# EAGLE design Main (EAGLE 9.5.1)

## Sheet 1 of 2
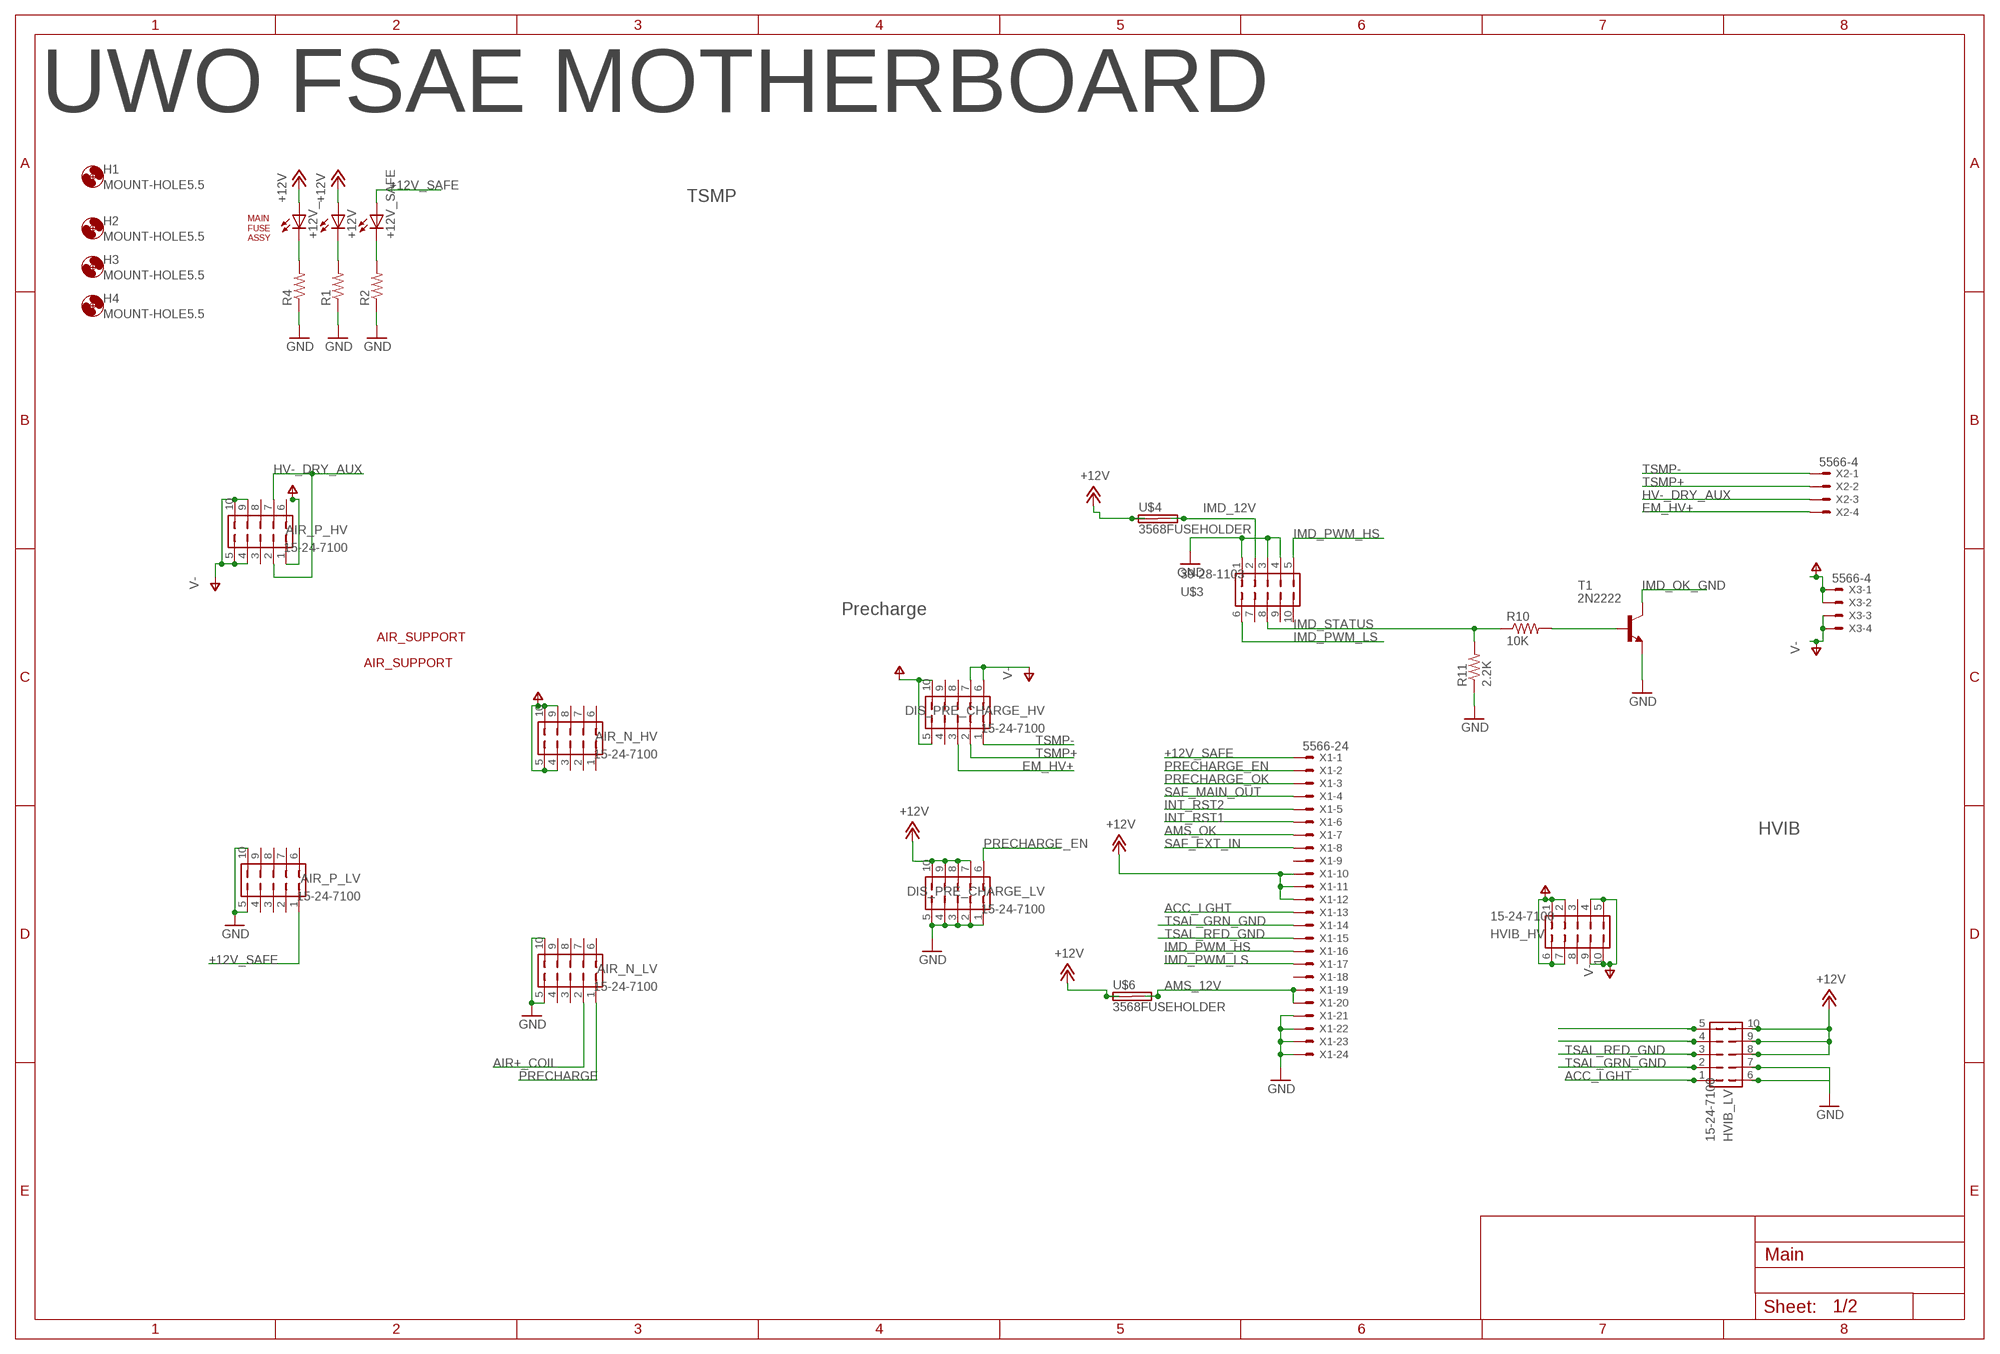
[diagram p0: schematic, sheet 1]

### Parts
+12V  LED3MM  [LED3MM]
+12V_  LED3MM  [LED3MM]
+12V_SAFE  LED3MM  [LED3MM]
AIR_N_HV  15-24-7100  [5566-10-BMI]
AIR_N_LV  15-24-7100  [5566-10-BMI]
AIR_P_HV  15-24-7100  [5566-10-BMI]
AIR_P_LV  15-24-7100  [5566-10-BMI]
DIS_PRE_CHARGE_HV  15-24-7100  [5566-10-BMI]
DIS_PRE_CHARGE_LV  15-24-7100  [5566-10-BMI]
H1  MOUNT-HOLE5.5  [5,5]
H2  MOUNT-HOLE5.5  [5,5]
H3  MOUNT-HOLE5.5  [5,5]
H4  MOUNT-HOLE5.5  [5,5]
HVIB_HV  15-24-7100  [5566-10-BMI]
HVIB_LV  15-24-7100  [5566-10-BMI]
R1  R-US_R0805  [R0805]
R2  R-US_R0805  [R0805]
R4  R-US_R0805  [R0805]
R10  10K  R-US_M0805  [M0805]
R11  2.2K  R-US_M0805  [M0805]
T1  2N2222  [TO92-EBC-OVAL]
U$1  MAINFUSEASSY  [MAINFUSEASSY]
U$3  39-28-1103  [39-28-1103]
U$4  3568FUSEHOLDER  [3568]
U$6  3568FUSEHOLDER  [3568]
U$7  AIR_SUPPORT  [AIR_SUPPORT]
U$8  AIR_SUPPORT  [AIR_SUPPORT]
X1  5566-24  [5566-24]
X2  5566-4  [5566-4]
X3  5566-4  [5566-4]

### Nets
+12V: +12V.A +12V_.A DIS_PRE_CHARGE_LV.7 DIS_PRE_CHARGE_LV.8 DIS_PRE_CHARGE_LV.9 DIS_PRE_CHARGE_LV.10 HVIB_LV.8 HVIB_LV.9 HVIB_LV.10 U$4.L1(1A) U$4.L2(1B) U$6.L1(1A) U$6.L2(1B) X1.10 X1.11 X1.12 ; also sheet 2
+12V_SAFE: +12V_SAFE.A AIR_P_LV.1 X1.1 ; also sheet 2
ACC_LGHT: HVIB_LV.1 X1.13
AIR+_COIL: AIR_N_LV.2 ; also sheet 2
AMS_12V: U$6.R1(2A) U$6.R2(2B) X1.19 X1.20
AMS_OK: X1.7 ; also sheet 2
EM_HV+: DIS_PRE_CHARGE_HV.3 X2.4
GND: AIR_N_LV.5 AIR_N_LV.10 AIR_P_LV.5 AIR_P_LV.10 DIS_PRE_CHARGE_LV.1 DIS_PRE_CHARGE_LV.2 DIS_PRE_CHARGE_LV.3 DIS_PRE_CHARGE_LV.4 DIS_PRE_CHARGE_LV.5 HVIB_LV.7 R1.1 R2.1 R4.1 R11.1 T1.E U$3.1 U$3.3 U$3.4 X1.21 X1.22 X1.23 X1.24 ; also sheet 2
HV-_DRY_AUX: AIR_P_HV.2 AIR_P_HV.7 X2.3
IMD_12V: U$3.2 U$4.R1(2A) U$4.R2(2B)
IMD_OK_GND: T1.C ; also sheet 2
IMD_PWM_HS: U$3.5 X1.16
IMD_PWM_LS: U$3.6 X1.17
IMD_STATUS: R10.1 R11.2 U$3.8
INT_RST1: X1.6 ; also sheet 2
INT_RST2: X1.5 ; also sheet 2
N$1: HVIB_LV.6
N$2: +12V.K(C) R1.2
N$3: R10.2 T1.B
N$5: +12V_.K(C) R4.2
N$6: +12V_SAFE.K(C) R2.2
N$12: HVIB_LV.4
N$16: HVIB_LV.5
PRECHARGE: AIR_N_LV.1 ; also sheet 2
PRECHARGE_EN: DIS_PRE_CHARGE_LV.6 X1.2 ; also sheet 2
PRECHARGE_OK: X1.3 ; also sheet 2
SAF_EXT_IN: X1.8 ; also sheet 2
SAF_MAIN_OUT: X1.4 ; also sheet 2
TSAL_GRN_GND: HVIB_LV.2 X1.14
TSAL_RED_GND: HVIB_LV.3 X1.15
TSMP+: DIS_PRE_CHARGE_HV.2 X2.2
TSMP-: DIS_PRE_CHARGE_HV.1 X2.1
V+: AIR_N_HV.4 AIR_N_HV.5 AIR_N_HV.9 AIR_N_HV.10 AIR_P_HV.1 AIR_P_HV.6 DIS_PRE_CHARGE_HV.5 DIS_PRE_CHARGE_HV.10 HVIB_HV.1 HVIB_HV.2 HVIB_HV.6 HVIB_HV.7 X3.1 X3.2
V-: AIR_P_HV.4 AIR_P_HV.5 AIR_P_HV.9 AIR_P_HV.10 DIS_PRE_CHARGE_HV.6 DIS_PRE_CHARGE_HV.7 HVIB_HV.4 HVIB_HV.5 HVIB_HV.9 HVIB_HV.10 X3.3 X3.4
Unconnected: AIR_N_HV.1 AIR_N_HV.2 AIR_N_HV.3 AIR_N_HV.6 AIR_N_HV.7 AIR_N_HV.8 AIR_N_LV.3 AIR_N_LV.4 AIR_N_LV.6 AIR_N_LV.7 AIR_N_LV.8 AIR_N_LV.9 AIR_P_HV.3 AIR_P_HV.8 AIR_P_LV.2 AIR_P_LV.3 AIR_P_LV.4 AIR_P_LV.6 AIR_P_LV.7 AIR_P_LV.8 AIR_P_LV.9 DIS_PRE_CHARGE_HV.4 DIS_PRE_CHARGE_HV.8 DIS_PRE_CHARGE_HV.9 HVIB_HV.3 HVIB_HV.8 U$3.7 U$3.9 U$3.10 X1.9 X1.18

### Notes on the sheet
- UWO FSAE MOTHERBOARD
- TSMP
- Precharge
- HVIB

## Sheet 2 of 2
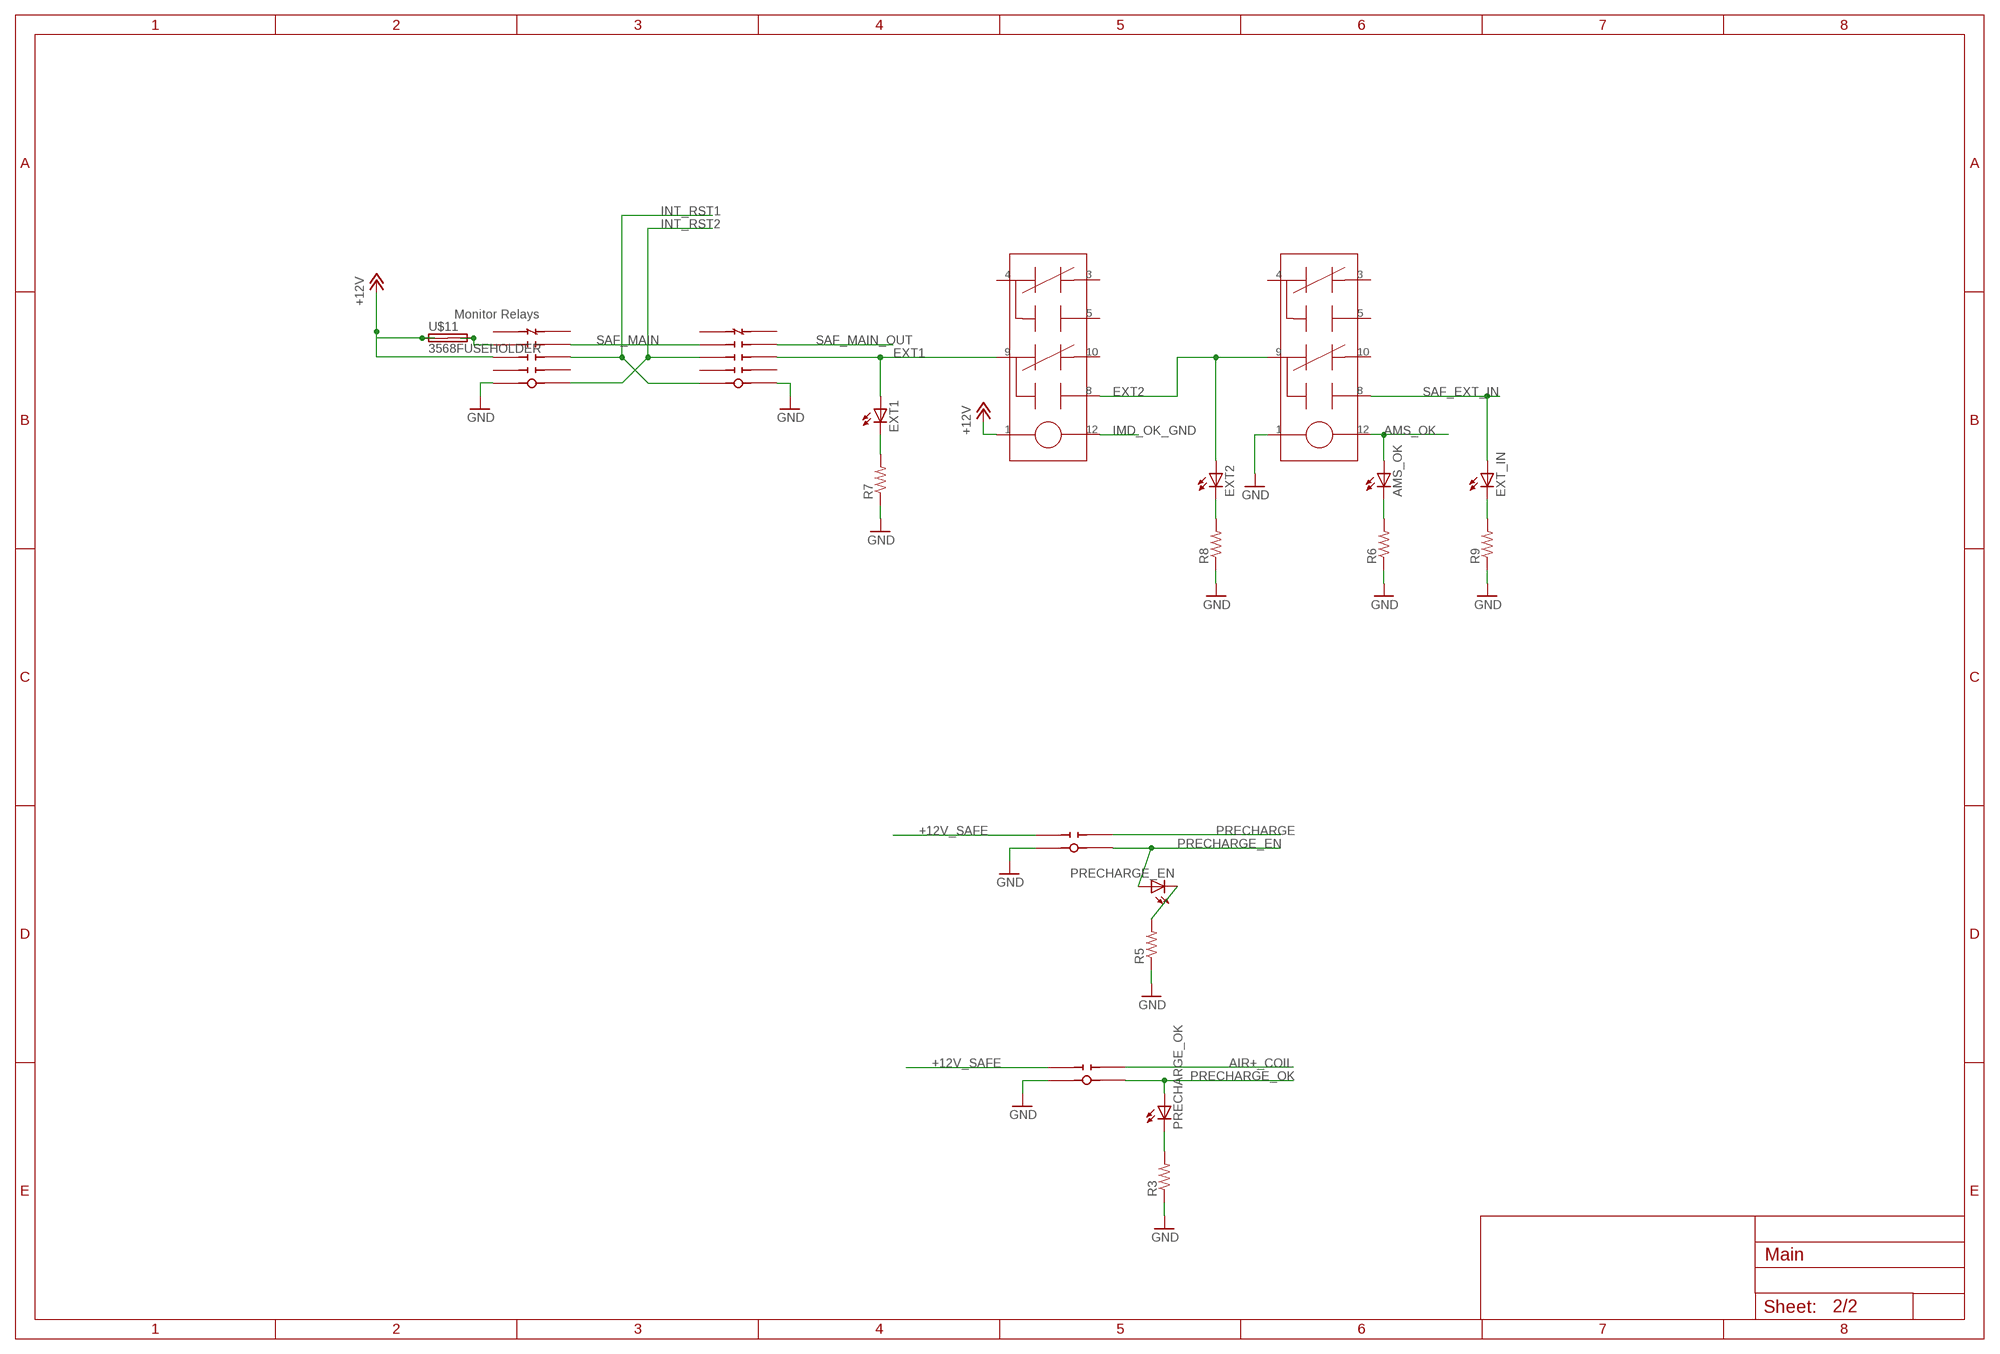
[diagram p1: schematic, sheet 2]

### Parts
AMS_OK  LED3MM  [LED3MM]
EXT1  LED3MM  [LED3MM]
EXT2  LED3MM  [LED3MM]
EXT_IN  LED3MM  [LED3MM]
PRECHARGE_EN  LED3MM  [LED3MM]
PRECHARGE_OK  LED3MM  [LED3MM]
R3  R-US_R0805  [R0805]
R5  R-US_R0805  [R0805]
R6  R-US_R0805  [R0805]
R7  R-US_R0805  [R0805]
R8  R-US_R0805  [R0805]
R9  R-US_R0805  [R0805]
U$2  SR4M4012_TE  [SR4M4012_FOOT]
U$5  SR4M4012_TE  [SR4M4012_FOOT]
U$9  G5NB-1A-E  [G5NB-1A-E]
U$10  G5NB-1A-E  [G5NB-1A-E]
U$11  3568FUSEHOLDER  [3568]
U$12  V23079B1203B301  [V23079B1203B301]
U$13  V23079B1203B301  [V23079B1203B301]

### Nets
+12V: U$2.NOA2 U$11.L1(1A) U$11.L2(1B) U$12.1 ; also sheet 1
+12V_SAFE: U$9.2(NOA1) U$10.2(NOA1) ; also sheet 1
AIR+_COIL: U$9.3(NOB1) ; also sheet 1
AMS_OK: AMS_OK.A U$13.12 ; also sheet 1
EXT1: EXT1.A U$5.NOB2 U$12.9
EXT2: EXT2.A U$12.8 U$13.9
GND: R3.1 R5.1 R6.1 R7.1 R8.1 R9.1 U$2.COIL+ U$5.COIL- U$9.1(COIL+) U$10.1(COIL+) U$13.1 ; also sheet 1
IMD_OK_GND: U$12.12 ; also sheet 1
INT_RST1: U$2.NOB2 U$5.COIL+ ; also sheet 1
INT_RST2: U$2.COIL- U$5.NOA2 ; also sheet 1
N$4: U$2.NOA3 U$11.R1(2A) U$11.R2(2B)
N$7: PRECHARGE_EN.K(C) R5.2
N$8: PRECHARGE_OK.K(C) R3.2
N$11: AMS_OK.K(C) R6.2
N$13: EXT1.K(C) R7.2
N$14: EXT2.K(C) R8.2
N$15: EXT_IN.K(C) R9.2
PRECHARGE: U$10.3(NOB1) ; also sheet 1
PRECHARGE_EN: PRECHARGE_EN.A U$10.4(COIL-) ; also sheet 1
PRECHARGE_OK: PRECHARGE_OK.A U$9.4(COIL-) ; also sheet 1
SAF_EXT_IN: EXT_IN.A U$13.8 ; also sheet 1
SAF_MAIN: U$2.NOB3 U$5.NOA3
SAF_MAIN_OUT: U$5.NOB3 ; also sheet 1
Unconnected: U$2.NCA4 U$2.NCB4 U$2.NOA1 U$2.NOB1 U$5.NCA4 U$5.NCB4 U$5.NOA1 U$5.NOB1 U$12.3 U$12.4 U$12.5 U$12.10 U$13.3 U$13.4 U$13.5 U$13.10

### Notes on the sheet
- Monitor Relays

## Library data of the parts
+12V +12V_ +12V_SAFE AMS_OK EXT1 EXT2 EXT_IN PRECHARGE_EN PRECHARGE_OK = ACC-MB-R0:LED: LED OSRAM: - CHIPLED LG R971, LG N971, LY N971, LG Q971, LY Q971, LO R971, LY R971 LH N974, LH R974 LS Q976, LO Q976, LY Q976 LO Q996 - Hyper CHIPLED LW Q18S LB Q993, LB Q99A, LB R99A - SideLED LS A670, LO A670, LY A670, LG A670, LP A670 LB A673, LV A673, LT A673, LW A673 LH A674 LY A675 LS A676, LA A676, LO A676, LY A676, LW A676 LS A679, LY A679, LG A679 - Hyper Micro SIDELED® LS Y876, LA Y876, LO Y876, LY Y876 LT Y87S - SmartLED LW L88C, LW L88S LB L89C, LB L89S, LG L890 LS L89K, LO L89K, LY L89K LS L896, LA L896, LO L896, LY L896 - TOPLED LS T670, LO T670, LY T670, LG T670, LP T670 LSG T670, LSP T670, LSY T670, LOP T670, LYG T670 LG T671, LOG T671, LSG T671 LB T673, LV T673, LT T673, LW T673 LH T674 LS T676, LA T676, LO T676, LY T676, LB T676, LH T676, LSB T676, LW T676 LB T67C, LV T67C, LT T67C, LS T67K, LO T67K, LY T67K, LW E67C LS E67B, LA E67B, LO E67B, LY E67B, LB E67C, LV E67C, LT E67C LW T67C LS T679, LY T679, LG T679 LS T770, LO T770, LY T770, LG T770, LP T770 LB T773, LV T773, LT T773, LW T773 LH T774 LS E675, LA E675, LY E675, LS T675 LS T776, LA T776, LO T776, LY T776, LB T776 LHGB T686 LT T68C, LB T68C - Hyper Mini TOPLED® LB M676 - Mini TOPLED Santana® LG M470 LS M47K, LO M47K, LY M47K Source: http://www.osram.convergy.de LUXEON: - LUMILED® LXK2-PW12-R00, LXK2-PW12-S00, LXK2-PW14-U00, LXK2-PW14-V00 LXK2-PM12-R00, LXK2-PM12-S00, LXK2-PM14-U00 LXK2-PE12-Q00, LXK2-PE12-R00, LXK2-PE12-S00, LXK2-PE14-T00, LXK2-PE14-U00 LXK2-PB12-K00, LXK2-PB12-L00, LXK2-PB12-M00, LXK2-PB14-N00, LXK2-PB14-P00, LXK2-PB14-Q00 LXK2-PR12-L00, LXK2-PR12-M00, LXK2-PR14-Q00, LXK2-PR14-R00 LXK2-PD12-Q00, LXK2-PD12-R00, LXK2-PD12-S00 LXK2-PH12-R00, LXK2-PH12-S00 LXK2-PL12-P00, LXK2-PL12-Q00, LXK2-PL12-R00 Source: www.luxeon.com KINGBRIGHT: KA-3528ASYC Source: www.kingbright.com
AIR_N_HV AIR_N_LV AIR_P_HV AIR_P_LV DIS_PRE_CHARGE_HV DIS_PRE_CHARGE_LV HVIB_HV HVIB_LV = ACC-MB-R0:15-24-7100
H1-H4 = Main:MOUNT-HOLE: MOUNTING HOLE with drill center marker
R1-R11 = ACC-MB-R0:R-US_: RESISTOR, American symbol; SPICEPREFIX: R
T1 = adafruit:2N2222: NPN TRANSISTOR Big oval pads
U$1 = ACC-MB-R0:MAINFUSEASSY
U$2 U$5 = ACC-MB-R0:SR4M4012_TE
U$3 = ACC-MB-R0:39-28-1103
U$4 U$6 U$11 = ACC-MB-R0:3568FUSEHOLDER: 3568 20AMP 500VAC
U$7 U$8 = ACC-MB-R0:AIR_SUPPORT
U$9 U$10 = ACC-MB-R0:G5NB-1A-E
U$12 U$13 = ACC-MB-R0:V23079B1203B301
X1 = ACC-MB-R0:5566-24: Mini FIT connector 24 pol Source: http://www.molex.com; MF: MOLEX; OC_FARNELL: unknown; OC_NEWARK: unknown
X2 X3 = ACC-MB-R0:5566-4: Mini FIT connector 4 pol Source: http://www.molex.com; MF: MOLEX; OC_FARNELL: unknown; OC_NEWARK: unknown

## Net classes
0 default: width 0.1 mm, clearance 0.4 mm
1 LV: clearance 0.001 mm
2 HV: clearance 2.5 mm

## Board
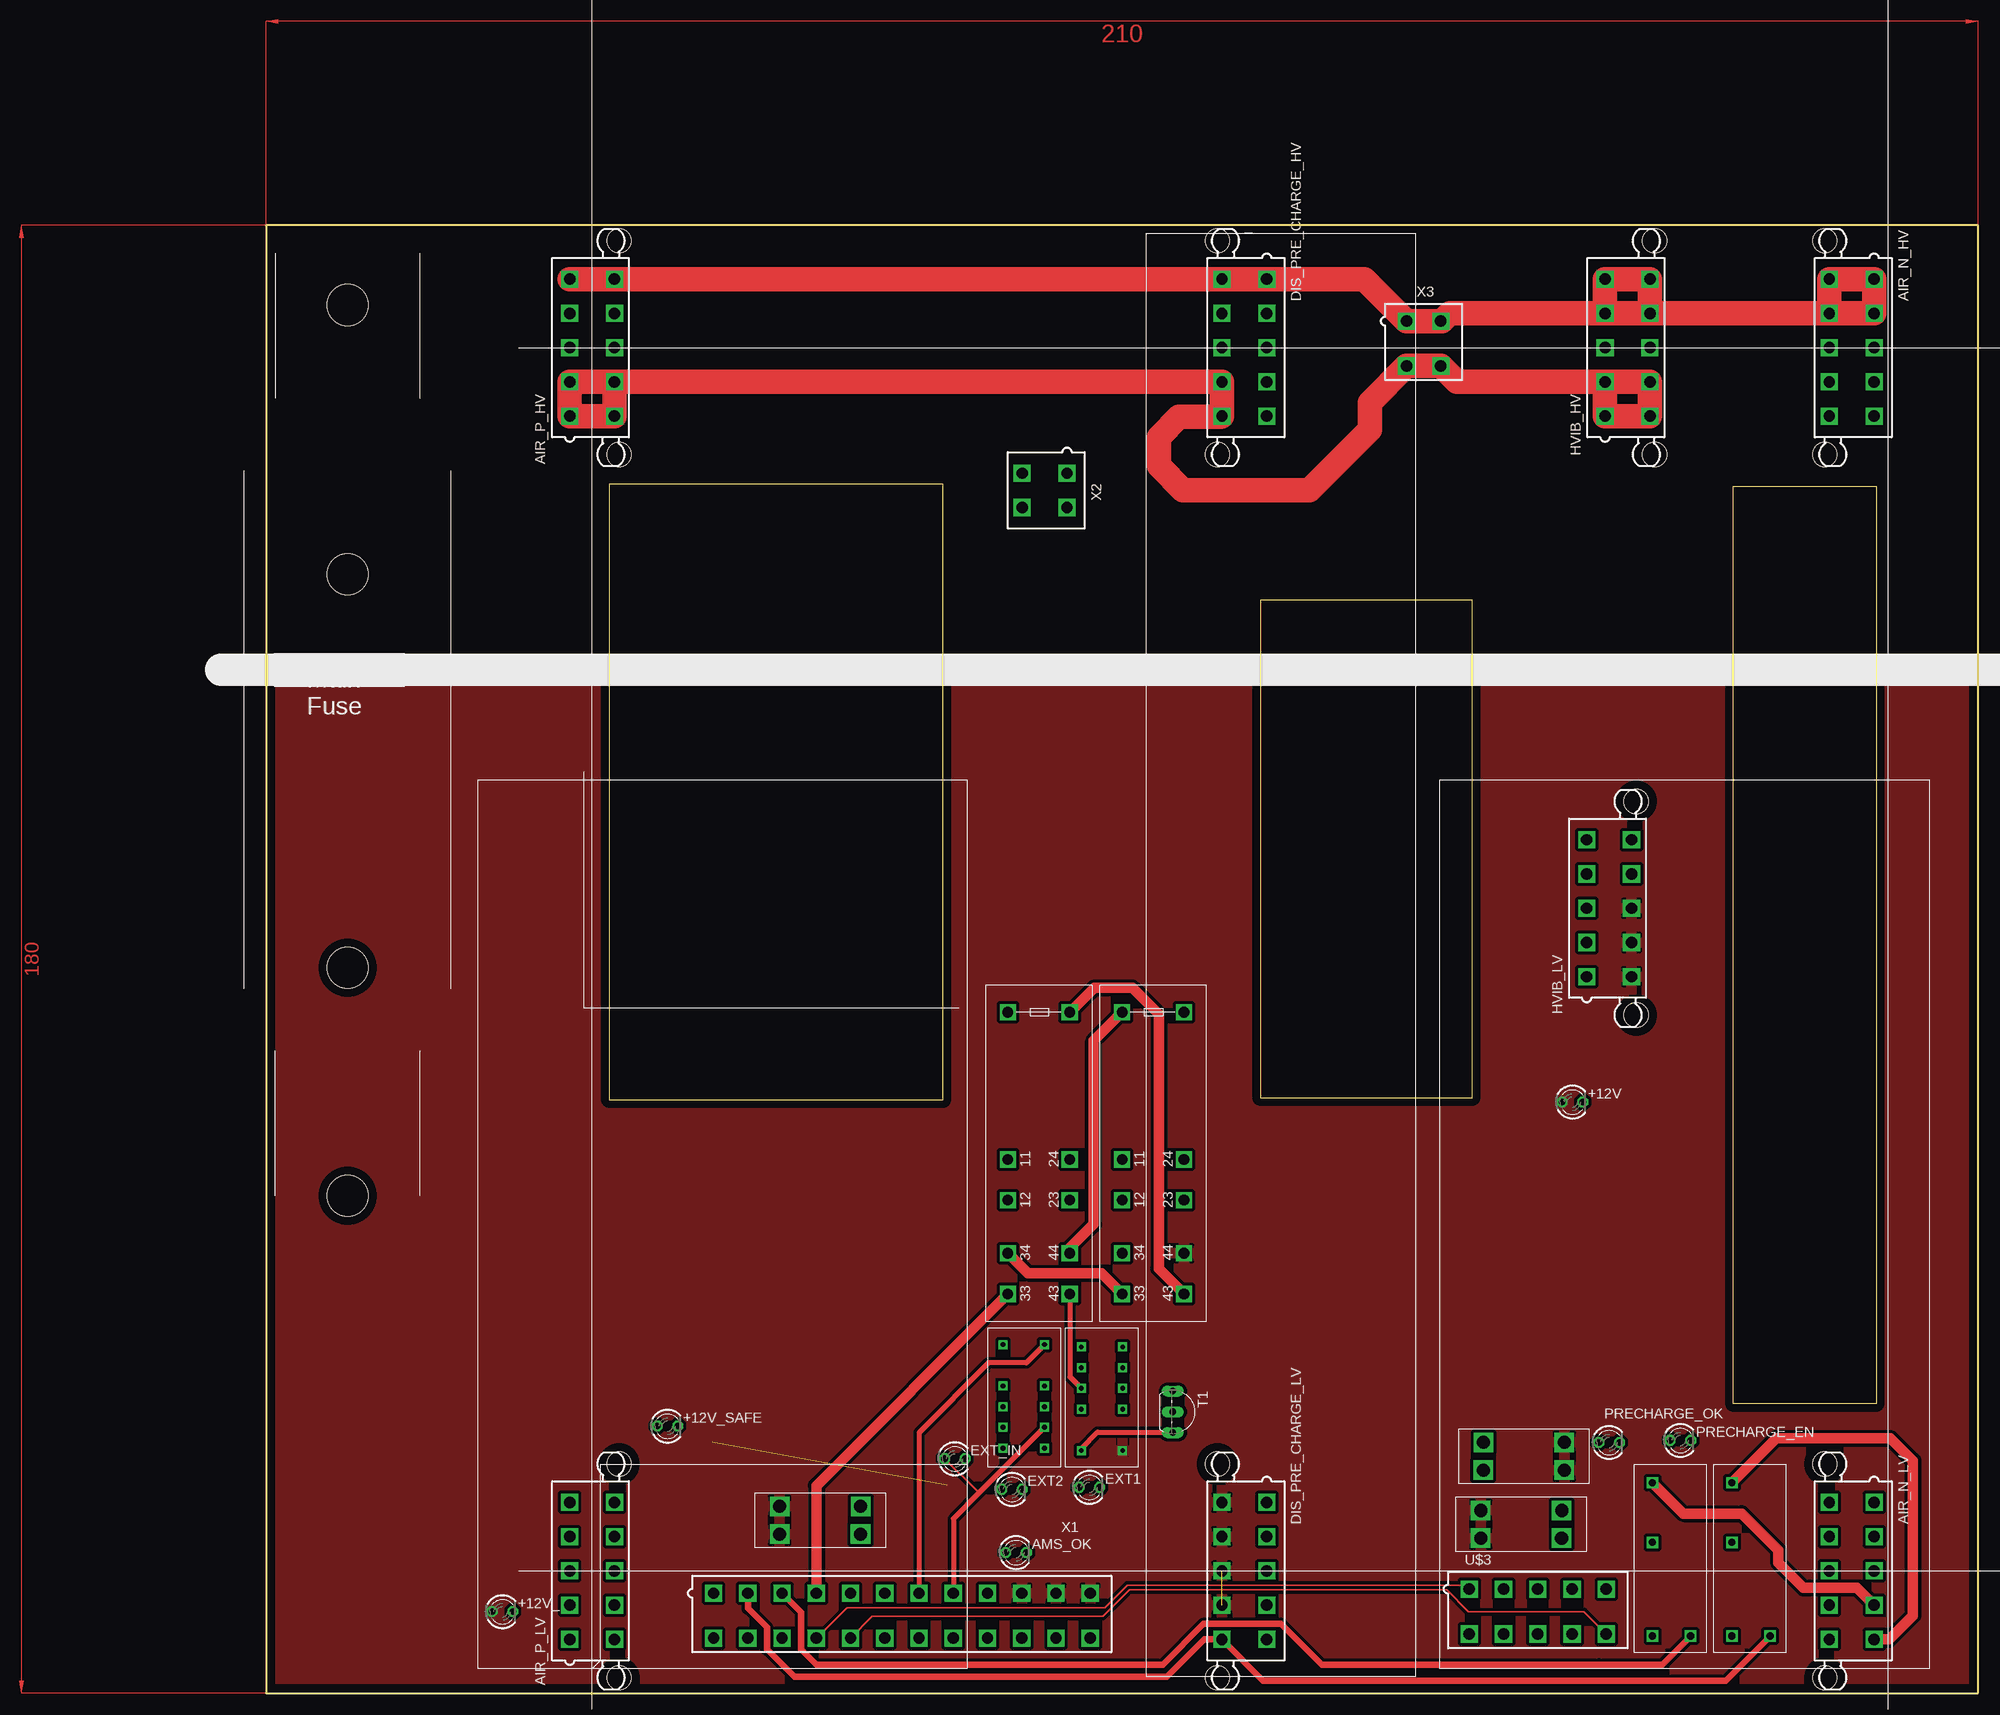
[diagram p2: board, top side]
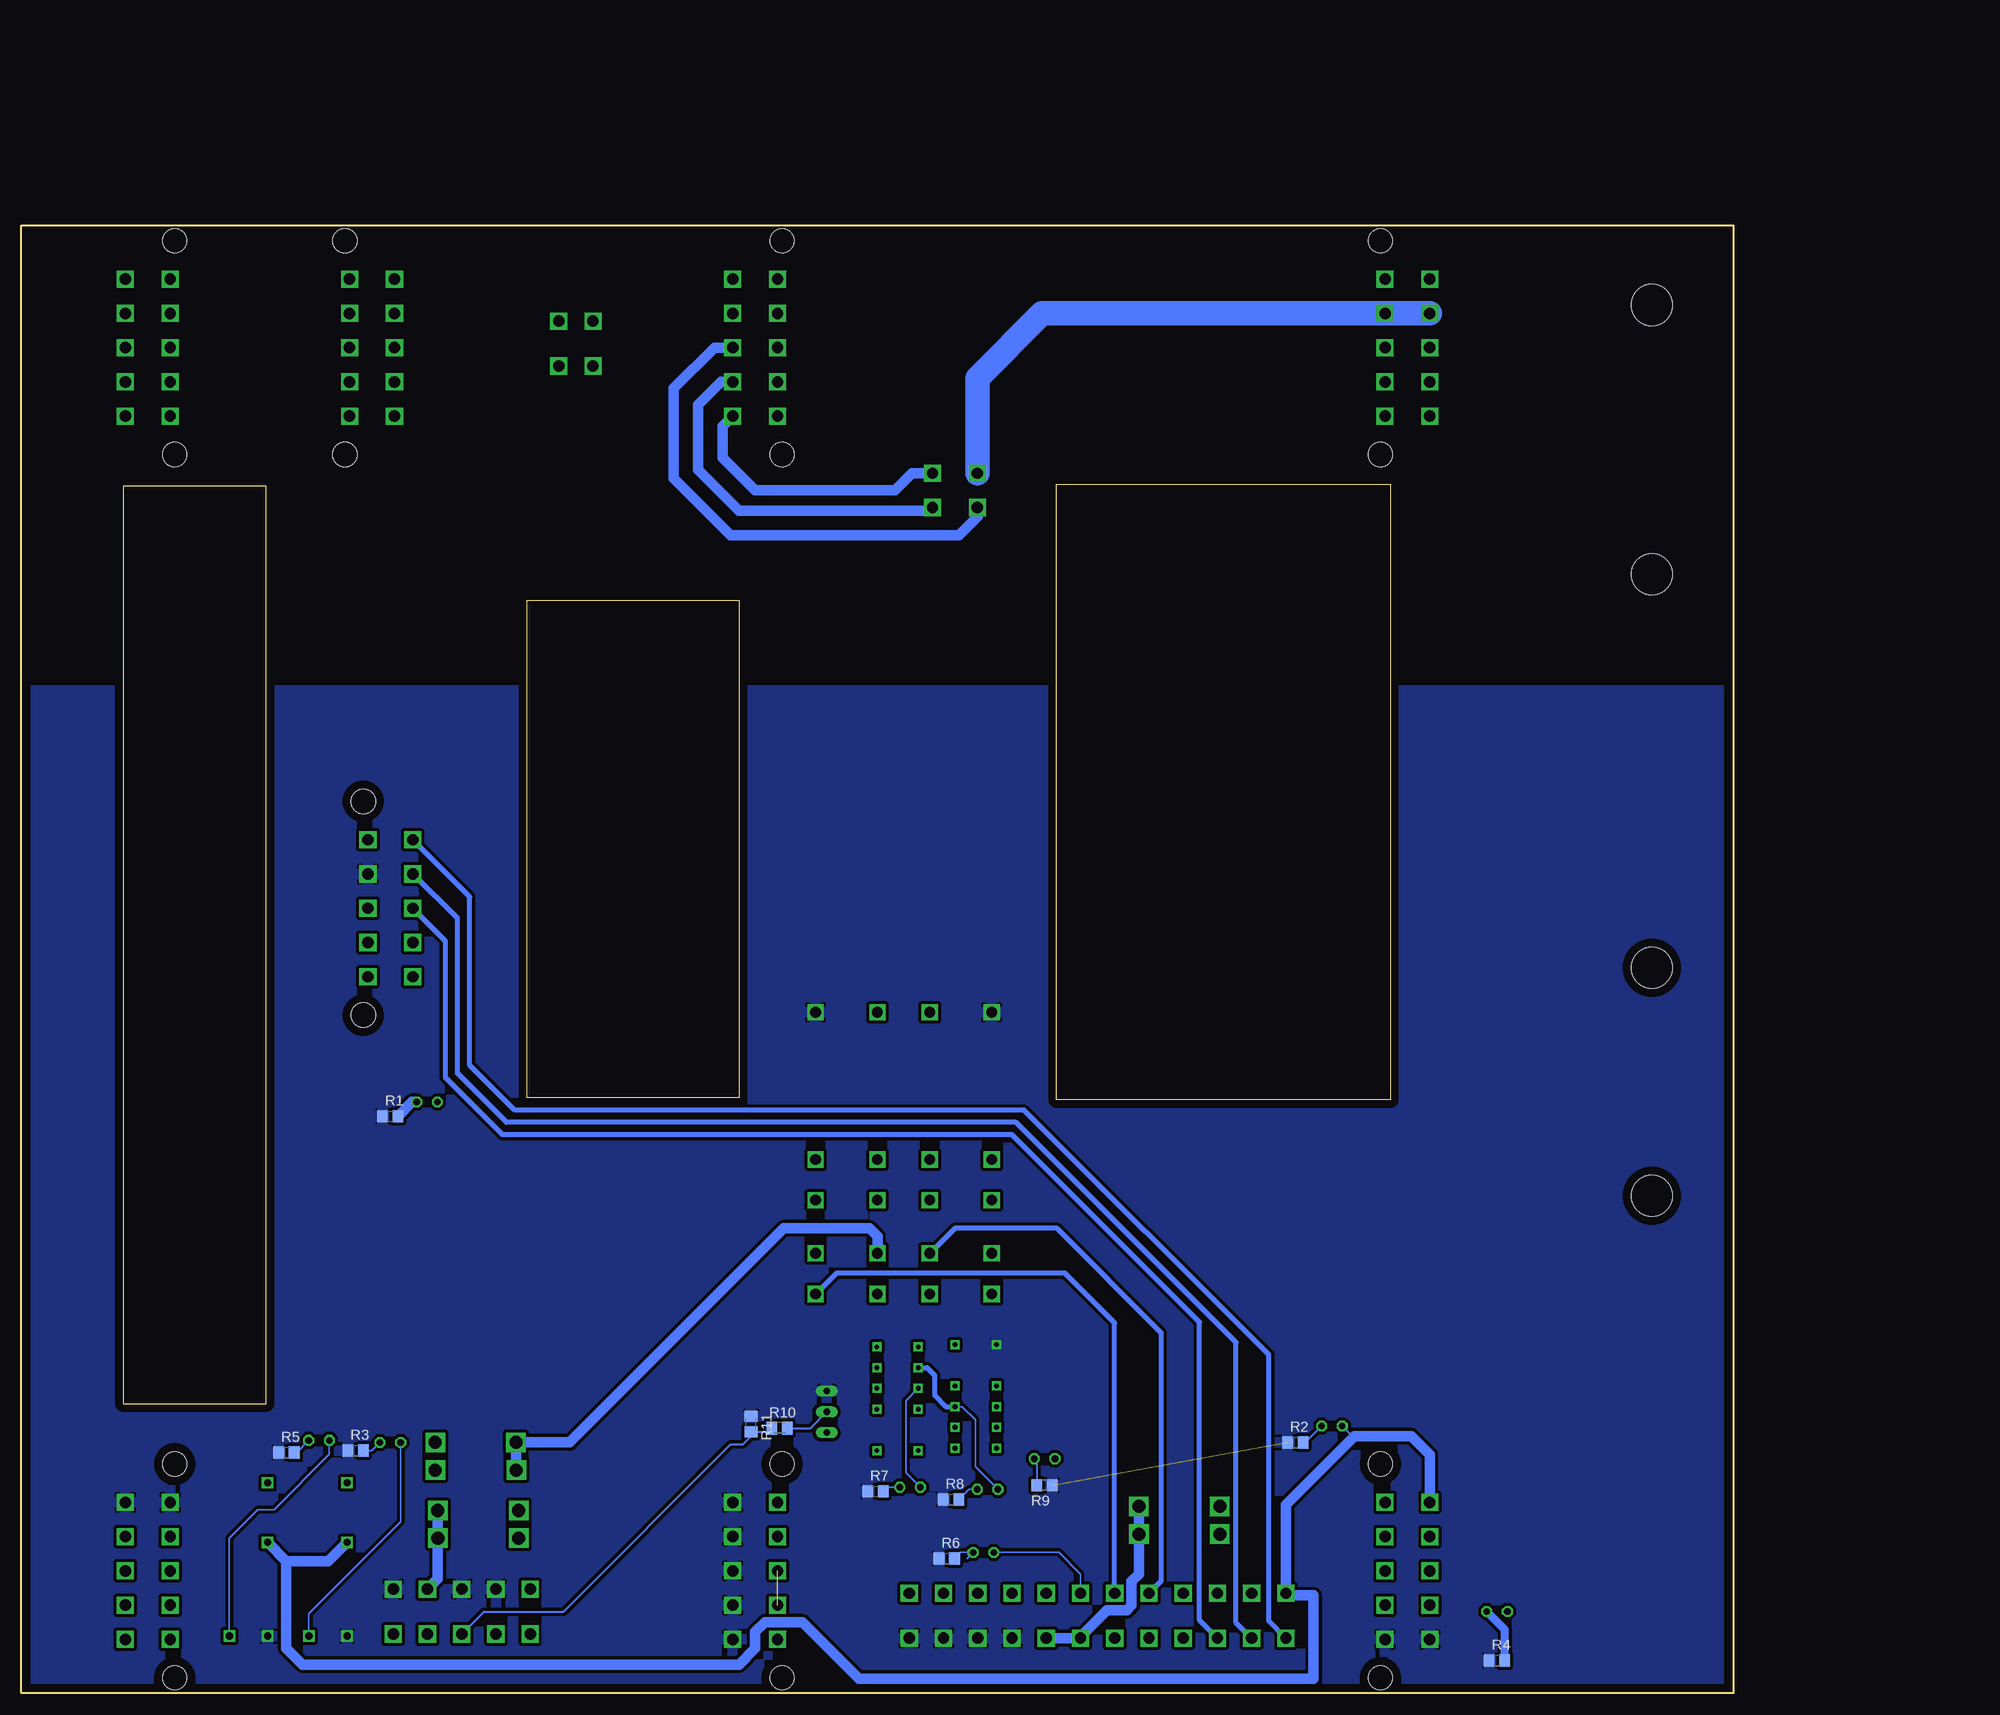
[diagram p3: board, bottom side, seen from below]

Size 210 x 180 mm. Coordinates in mm from the lower left corner, seen from the top.
Outline: 0,0 210,0 210,180 0,180 0,0
Outline: 42.05,148.27 42.05,72.77 83.05,72.77 83.05,148.27 42.05,148.27
Outline: 180,148 197.5,148 197.5,35.5 180,35.5 180,148
Outline: 122,134 122,73 148,73 148,134 122,134
Copper layers (1*16): Top 0.035mm / dielectric 1.5mm / Bottom 0.035mm
Design rules "default": minimum track width 6mil, minimum drill 0.35mm, track to track 6mil, track to pad 6mil, pad to pad 6mil, via to via 6mil, smd to smd 6mil, copper to edge 40mil, drill to drill 6mil, minimum pad ring 10mil, minimum via ring 8mil, stop-mask expansion 4mil, vias tented up to drill 0mil, thermal gap 10mil

### Footprints (pad centres in the part's own frame; a part is rotated, then mirrored left to right if it is on the bottom)
LED3MM = drill 0.813 octagon: A -1.27,0; K 1.27,0
5566-10-BMI = drill 1.4 square: 1 -8.4,-2.75; 2 -4.2,-2.75; 3 0,-2.75; 4 4.2,-2.75; 5 8.4,-2.75; 6 -8.4,2.75; 7 -4.2,2.75; 8 0,2.75; 9 4.2,2.75; 10 8.4,2.75 | hole 3: 13.1,3.31; -13.1,3.31
5,5 = hole 5.5: 0,0
R0805 = smd 1.3 x 1.5: 1 -0.95,0; 2 0.95,0
M0805 = smd 1.3 x 1.6: 1 -0.95,0; 2 0.95,0
TO92-EBC-OVAL = drill 0.813 long: B 0,-1.27; C 2.54,-1.27; E -2.54,-1.27
MAINFUSEASSY = hole 5.08: 0,0; 76.2,0; 27.94,0; 109.22,0
SR4M4012_FOOT = drill 1.3 pad 2 square: COIL+ 0,7.6; COIL- 0,0; NCA4 18.05,0; NCB4 23.05,0; NOA1 18.05,7.6; NOA2 29.55,7.6; NOA3 29.55,0; NOB1 23.05,7.6; NOB2 34.55,7.6; NOB3 34.55,0
39-28-1103 = drill 1.4 square: 1 -8.4,-2.75; 2 -4.2,-2.75; 3 0,-2.75; 4 4.2,-2.75; 5 8.4,-2.75; 6 -8.4,2.75; 7 -4.2,2.75; 8 0,2.75; 9 4.2,2.75; 10 8.4,2.75
3568 = drill 1.6 square: L1 0,3.4; L2 0,0; R1 9.94,3.4; R2 9.92,0
AIR_SUPPORT = hole 4.5: 0,0; 0,30; 35,30; 35,0
G5NB-1A-E = drill 0.9 square: 1 0,4.7; 2 11.5,4.7; 3 18.8,4.7; 4 0,0
V23079B1203B301 = drill 0.6 square: 1 0,-5.08; 3 5.08,-5.08; 4 7.62,-5.08; 5 10.16,-5.08; 6 12.7,-5.08; 7 12.7,0; 8 10.16,0; 9 7.62,0; 10 5.08,0; 12 0,0
5566-24 = drill 1.4 square: 1 23.1,-2.75; 2 18.9,-2.75; 3 14.7,-2.75; 4 10.5,-2.75; 5 6.3,-2.75; 6 2.1,-2.75; 7 -2.1,-2.75; 8 -6.3,-2.75; 9 -10.5,-2.75; 10 -14.7,-2.75; 11 -18.9,-2.75; 12 -23.1,-2.75; 13 23.1,2.75; 14 18.9,2.75; 15 14.7,2.75; 16 10.5,2.75; 17 6.3,2.75; 18 2.1,2.75; 19 -2.1,2.75; 20 -6.3,2.75; 21 -10.5,2.75; 22 -14.7,2.75; 23 -18.9,2.75; 24 -23.1,2.75
5566-4 = drill 1.4 square: 1 2.1,-2.75; 2 -2.1,-2.75; 3 2.1,2.75; 4 -2.1,2.75

### Placement (x,y rotation side)
+12V  160.25,72.5 0 top
+12V_  29,10 0 top
+12V_SAFE  49.25,32.75 0 top
AIR_N_HV  194.5,165 90 top
AIR_N_LV  194.5,15 90 top
AIR_P_HV  40,165 270 top
AIR_P_LV  40,15 270 top
AMS_OK  92,17.25 0 top
DIS_PRE_CHARGE_HV  120,165 90 top
DIS_PRE_CHARGE_LV  120,15 90 top
EXT1  101,25.25 0 top
EXT2  91.5,25 0 top
EXT_IN  84.5,28.75 0 top
H1  -77,125 0 top  (outside the outline)
H2  -57.38,15.61 0 top  (outside the outline)
H3  19.62,-221.36 0 top  (outside the outline)
H4  4.62,-85.33 0 top  (outside the outline)
HVIB_HV  167,165 270 top
HVIB_LV  164.75,96.25 270 top
PRECHARGE_EN  173.5,31 0 top
PRECHARGE_OK  164.75,30.75 0 top
R1  164.75,70.75 0 bottom
R2  53.75,30.75 0 bottom
R3  169,29.75 0 bottom
R4  29,4 0 bottom
R5  177.5,29.5 0 bottom
R6  96.5,16.5 0 bottom
R7  105.25,24.75 0 bottom
R8  96,23.75 0 bottom
R9  84.5,25.5 180 bottom
R10  117,32.5 0 bottom
R11  120.5,33 270 bottom
T1  112.5,34.5 270 top
U$1  10,61 90 top
U$2  105,83.5 270 top
U$3  156,10 180 top
U$4  149,19 0 top
U$5  91,83.5 270 top
U$6  63,19.5 0 top
U$7  156.5,-74 0 top  (outside the outline)
U$8  91.5,-78 0 top  (outside the outline)
U$9  174.75,7 90 top
U$10  184.5,7 90 top
U$11  159.25,30.75 180 top
U$12  100,29.75 90 top
U$13  95.5,42.75 270 top
X1  78,9.5 180 top
X2  95.5,147.5 90 top
X3  142,165.5 180 top

### Tracks (layer width: path | path; a pad name or v marks a point on that pad's centre or on a via)
+12V  (1 unrouted)
  pour Top: -16.5,123 221,123 221.5,122.5 221.5,-6 -20.5,-6 -21,-6.5 -21,119 -17,123
+12V_SAFE
  Bottom 0.2: +12V_SAFE.A 46.73,31.5 46.5,31.5
  Bottom 1.27: AIR_P_LV.1 37.25,29.25 39.5,31.5 46.5,31.5 54.9,23.1 X1.1 54.65,12 51.5,12 51.5,1.78 107.28,1.78 114.19,8.69 118.81,8.69 120,7.5 120,5.5 122,3.5 175.5,3.5 177.5,5.5 177.5,16.2 | 177.5,16.2 U$10.2 | U$9.2 172.35,16.2 177.5,16.2
ACC_LGHT
  Bottom 0.61: X1.13 57,8.85 57,41.5 87,71.5 149.5,71.5 155,77 155,97.65 HVIB_LV.1
AIR+_COIL
  Top 1.27: U$9.3 173.85,22 181,22 185.5,17.5 185.5,16 188.59,12.91 195.13,12.91 AIR_N_LV.2
AMS_12V
  Bottom 1.27: U$6.R1 72.94,19.52 U$6.R2 72.92,14.59 73.81,13.7 73.81,10.77 74.42,10.16 76.83,10.16 80.1,6.9 X1.19 X1.20
AMS_OK
  Top 0.61: U$13.12 93.25,40.5 88.64,40.5 80.1,31.95 X1.7
  Bottom 0.2: X1.7 80.1,14.6 82.75,17.25 AMS_OK.A
EM_HV+
  Bottom 1.27: DIS_PRE_CHARGE_HV.3 125,165 130,160 130,149 123,142 95,142 92.75,144.25 X2.4
EXT1
  Top 0.61: U$5.NOB2 98.6,38.77 U$12.9
  Bottom 0.2: EXT1.A 101.5,27.02 101.5,35.87 U$12.9
EXT2
  Bottom 0.2: 90.23,24.7 EXT2.A 93,27.77 93,33.5 94.63,35.13 U$13.9
  Bottom 0.61: U$12.8 98.91,39.91 98,39 98,36.5 96.63,35.13 U$13.9
GND  (1 unrouted)
  pour Bottom: -17,123 227,123 227,-14 226,-15 -36.5,-15 -40,-11.5 -40,100
HV-_DRY_AUX
  Bottom 3: AIR_P_HV.2 AIR_P_HV.7 84.8,169.2 92.75,161.25 X2.3
IMD_12V
  Bottom 1.27: U$4.R1 158.94,19.02 U$4.R2 158.92,14.03 U$3.2
IMD_OK_GND
  Top 0.61: U$12.12 100,30 102,32 111.19,32 T1.C
IMD_PWM_HS
  Top 0.2: U$3.5 147.1,13.25 105.64,13.25 102.88,10.49 71.24,10.49 X1.16
IMD_PWM_LS
  Top 0.2: X1.17 74.35,9.4 102.64,9.4 105.89,12.65 144.85,12.65 147.5,10 161.65,10 U$3.6
IMD_STATUS
  Bottom 0.254: U$3.8 153.25,10 143.5,10 123,30.5 121.5,30.5 120.5,31.5 R11.2 118.4,32.05 R10.1
INT_RST1
  Top 1.27: U$5.COIL+ 101.6,86.5 106.25,86.5 109.5,83.25 109.5,52.05 U$2.NOB2
  Bottom 0.61: X1.6 75.9,45.4 82,51.5 110,51.5 112.55,48.95 U$2.NOB2
INT_RST2
  Top 1.27: U$5.NOA2 98.6,54.6 101.5,57.5 101.5,80 U$2.COIL-
  Bottom 0.61: X1.5 70.2,13.75 70.2,44.2 83,57 95.5,57 98.6,53.9
  Bottom 1.27: 98.6,53.9 U$5.NOA2
N$2
  Bottom 1.27: +12V.K 162.05,72.5 R1.2
N$3
  Bottom 0.254: R10.2 113.23,32.5 T1.B
N$4
  Bottom 1.27: U$2.NOA3 105,56 106,57 116.5,57 142.75,30.75 U$11.R2 149.33,27.37 U$11.R1
N$5
  Bottom 1: R4.2 28.05,7.78 +12V_.K
N$6
  Bottom 0.2: +12V_SAFE.K 52.52,30.75 R2.2
N$7
  Bottom 0.2: R5.2 176.27,29.5 PRECHARGE_EN.K
N$8
  Bottom 0.2: 166.05,30.75 PRECHARGE_OK.K 167.02,29.75 R3.2
N$11
  Bottom 0.2: 94.02,16.5 AMS_OK.K 94.8,17.25 R6.2
N$13
  Bottom 0.2: EXT1.K 103.8,25.25 R7.2
N$14
  Bottom 0.2: EXT2.K 93.8,25 R8.2
N$15
  Bottom 0.2: 86.02,28.5 EXT_IN.K 85.45,28.43 R9.2
PRECHARGE
  Top 1.27: U$10.3 185.25,31.25 199.25,31.25 202,28.5 202,9.5 199.1,6.6 AIR_N_LV.1
PRECHARGE_EN
  Top 0.813: X1.2 59.1,10.41 61.44,8.07 61.44,5.37 64.81,2 110.5,2 115.1,6.6 DIS_PRE_CHARGE_LV.6 122.3,1.55 179.05,1.55 U$10.4
  Bottom 0.2: PRECHARGE_EN.A 172.23,29.27 179,22.5 181,22.5 184.5,19 U$10.4
PRECHARGE_OK
  Top 0.2: 163.48,3.52 163.5,3.5
  Top 0.813: X1.3 65.64,9.91 65.64,5.37 66,5.01 66,5 67.5,3.5 110,3.5 115,8.5 124.5,8.5 129.5,3.5 163.5,3.5 171.25,3.5 U$9.4
  Bottom 0.2: PRECHARGE_OK.A 163.48,21.02 174.75,9.75 U$9.4
SAF_EXT_IN
  Top 0.2: EXT_IN.A 87.44,24.55 87.45,24.55
  Top 0.61: U$13.8 87.45,24.55 84.3,21.39 X1.8
SAF_MAIN
  Top 1.27: U$5.NOA3 93.45,51.5 102.45,51.5 U$2.NOB3
SAF_MAIN_OUT
  Top 1.27: U$5.NOB3 67.5,25.45 X1.4
TSAL_GRN_GND
  Bottom 0.61: X1.14 61,8.65 61,43 88,70 150.5,70 156.5,76 156.5,95 161.95,100.45 HVIB_LV.2
TSAL_RED_GND
  Bottom 0.61: X1.15 65.5,8.95 65.5,45.5 88.5,68.5 151,68.5 158,75.5 158,92.25 HVIB_LV.3
TSMP+
  Bottom 1.27: DIS_PRE_CHARGE_HV.2 124.2,160.8 127,158 127,150 122,145 98.65,145 X2.2
TSMP-
  Bottom 1.27: DIS_PRE_CHARGE_HV.1 124,155.35 124,151.5 120,147.5 102.85,147.5 100.75,149.6 X2.1
V+
  Top 3: AIR_P_HV.1 AIR_P_HV.6 DIS_PRE_CHARGE_HV.10 DIS_PRE_CHARGE_HV.5 134.75,173.4 X3.1 X3.2 144.25,168.25 145.2,169.2 HVIB_HV.2 | HVIB_HV.2 HVIB_HV.7 | HVIB_HV.7 HVIB_HV.6 HVIB_HV.1 HVIB_HV.2 | HVIB_HV.7 AIR_N_HV.9 | AIR_N_HV.9 AIR_N_HV.4 AIR_N_HV.5 AIR_N_HV.10 AIR_N_HV.9
V-
  Top 3: AIR_P_HV.9 AIR_P_HV.4 AIR_P_HV.5 AIR_P_HV.10 AIR_P_HV.9 | AIR_P_HV.9 DIS_PRE_CHARGE_HV.7 DIS_PRE_CHARGE_HV.6 117.15,156.5 112,156.5 109.5,154 109.5,150.5 112.5,147.5 128,147.5 135.4,154.9 135.4,158.25 X3.3 X3.4 146.05,160.8 HVIB_HV.4 | HVIB_HV.4 HVIB_HV.9 HVIB_HV.10 HVIB_HV.5 HVIB_HV.4
(copper drawn outside any net)
  shapes: Top area x2

### Text on the board
_tsilk: Main / Fuse | AIR-